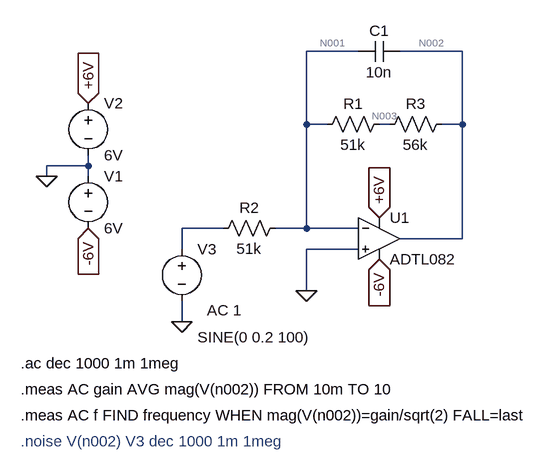
[diagram p0: schematic 150Hz_LPF.asc]
150Hz_LPF.asc, the LTspice schematic file:
Version 4
SHEET 1 880 680
WIRE 368 -128 288 -128
WIRE 528 -128 432 -128
WIRE 288 -16 288 -128
WIRE 320 -16 288 -16
WIRE 416 -16 400 -16
WIRE 528 -16 528 -128
WIRE 528 -16 496 -16
WIRE -48 48 -48 32
WIRE -48 48 -112 48
WIRE -112 64 -112 48
WIRE -48 64 -48 48
WIRE 160 144 96 144
WIRE 288 144 288 -16
WIRE 288 144 240 144
WIRE 368 144 288 144
WIRE 528 160 528 -16
WIRE 528 160 432 160
WIRE 96 176 96 144
WIRE 368 176 288 176
WIRE 288 240 288 176
WIRE 96 288 96 256
FLAG -112 64 0
FLAG 288 240 0
FLAG -48 -48 +6V
IOPIN -48 -48 In
FLAG 400 128 +6V
IOPIN 400 128 In
FLAG -48 144 -6V
IOPIN -48 144 In
FLAG 400 192 -6V
IOPIN 400 192 In
FLAG 96 288 0
SYMBOL voltage -48 48 R0
WINDOW 123 0 0 Left 0
WINDOW 39 0 0 Left 0
SYMATTR InstName V1
SYMATTR Value 6V
SYMBOL voltage -48 -64 R0
WINDOW 123 0 0 Left 0
WINDOW 39 0 0 Left 0
SYMATTR InstName V2
SYMATTR Value 6V
SYMBOL OpAmps\\ADTL082 400 96 R0
SYMATTR InstName U1
SYMBOL res 256 128 R90
WINDOW 0 0 56 VBottom 2
WINDOW 3 32 56 VTop 2
SYMATTR InstName R2
SYMATTR Value 51k
SYMBOL cap 432 -144 R90
WINDOW 0 0 32 VBottom 2
WINDOW 3 32 32 VTop 2
SYMATTR InstName C1
SYMATTR Value 10n
SYMATTR SpiceLine V=400
SYMBOL voltage 96 160 R0
WINDOW 3 24 152 Left 2
WINDOW 123 39 110 Left 2
WINDOW 39 0 0 Left 0
SYMATTR Value SINE(0 0.2 100)
SYMATTR Value2 AC 1
SYMATTR InstName V3
SYMBOL res 416 -32 R90
WINDOW 0 0 56 VBottom 2
WINDOW 3 32 56 VTop 2
SYMATTR InstName R1
SYMATTR Value 51k
SYMBOL res 512 -32 R90
WINDOW 0 0 56 VBottom 2
WINDOW 3 32 56 VTop 2
SYMATTR InstName R3
SYMATTR Value 56k
TEXT -152 352 Left 2 !.ac dec 1000 1m 1meg
TEXT -152 392 Left 2 !.meas AC gain AVG mag(V(n002)) FROM 10m TO 10
TEXT -152 432 Left 2 !.meas AC f FIND frequency WHEN mag(V(n002))=gain/sqrt(2) FALL=last
TEXT -152 472 Left 2 ;.noise V(n002) V3 dec 1000 1m 1meg

The netlist it stands for:
* 150Hz_LPF.asc
V1 0 -6V 6V
V2 +6V 0 6V
XU1 0 N001 +6V -6V N002 ADTL082  ; pins In+ In- V+ V- OUT
R2 N001 N004 51k
C1 N002 N001 10n V=400
V3 N004 0 SINE(0 0.2 100) AC 1
R1 N003 N001 51k
R3 N002 N003 56k
.ac dec 1000 1m 1meg
.meas AC gain AVG mag(V(n002)) FROM 10m TO 10
.meas AC f FIND frequency WHEN mag(V(n002))=gain/sqrt(2) FALL=last
* .noise V(n002) V3 dec 1000 1m 1meg
.lib ADI.lib
.backanno
.end

* Results of the author's LTspice run, read from the files saved beside the schematic
* Operating Point, zero values left out:
*   V(-6v) = -6 V
*   V(+6v) = 6 V
*   V(n002) = 214 nV
*   V(n003) = 102 nV
*   I(R3) = 2 pA
*   I(R1) = 2 pA
*   I(V2) = -4.051 mA
*   I(V1) = -4.051 mA
*   Ix(u1:1) = 2 pA
*   Ix(u1:2) = 2 pA
*   Ix(u1:3) = 4.051 mA
*   Ix(u1:4) = -4.051 mA
*   Ix(u1:5) = -2 pA
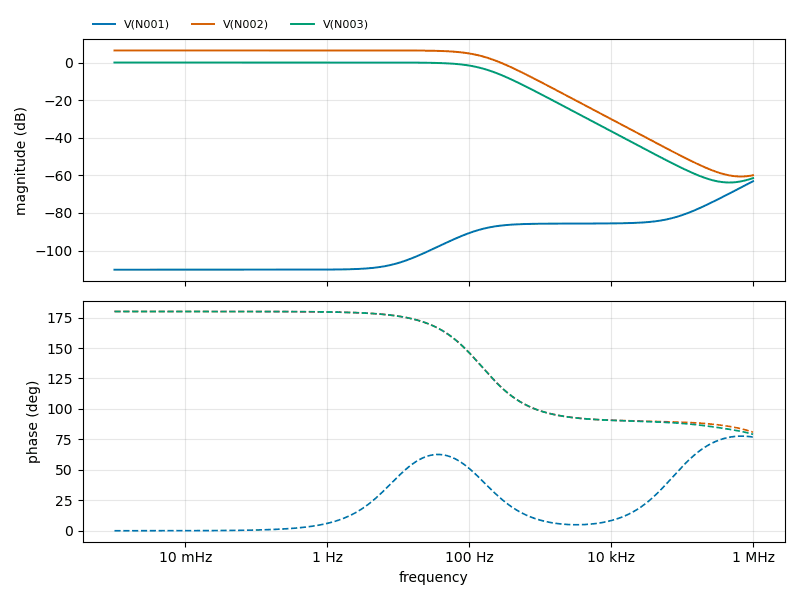
[diagram p1: AC Analysis of 150Hz_LPF.asc, plotted from the saved traces]
* AC Analysis, 1 run:
*   V(N001): -110.14 dB at 1 mHz, -63.11 dB at 1 MHz, peak -63.11 dB at 1 MHz, 3 dB below the peak at 701.8 kHz
*   V(N002): 6.44 dB at 1 mHz, -59.95 dB at 1 MHz, peak 6.44 dB at 1 mHz, 3 dB below the peak at 148.7 Hz
*   V(N003): -0.00 dB at 1 mHz, -61.47 dB at 1 MHz, peak -0.00 dB at 1 mHz, 3 dB below the peak at 148.7 Hz